# EAGLE schematic SGC.0 (EAGLE 7.0.0)
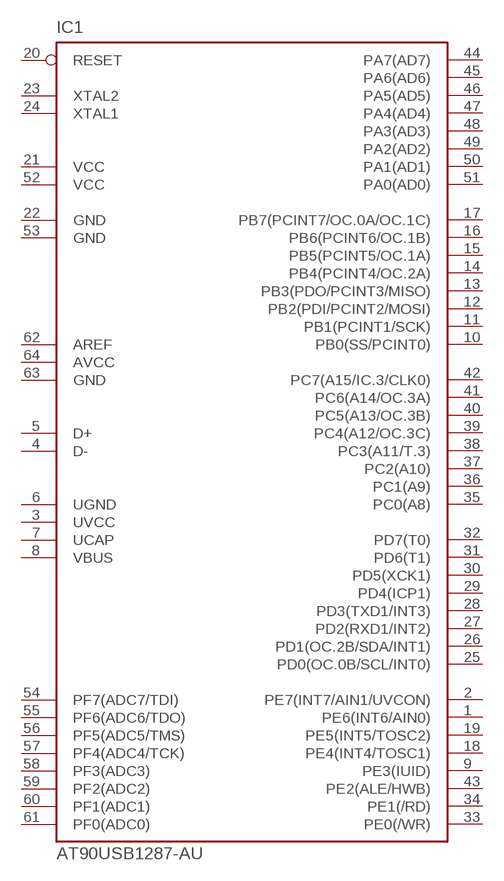
[diagram p0: schematic, sheet 1]

## Parts
IC1  AT90USB1287-AU  [TQFP64]
Unconnected: IC1.1(PE6(INT6/AIN0)) IC1.2(PE7(INT7/AIN1/UVCON)) IC1.4(D-) IC1.5(D+) IC1.9(PE3(IUID)) IC1.10(PB0(SS/PCINT0)) IC1.11(PB1(PCINT1/SCK)) IC1.12(PB2(PDI/PCINT2/MOSI)) IC1.13(PB3(PDO/PCINT3/MISO)) IC1.14(PB4(PCINT4/OC.2A)) IC1.15(PB5(PCINT5/OC.1A)) IC1.16(PB6(PCINT6/OC.1B)) IC1.17(PB7(PCINT7/OC.0A/OC.1C)) IC1.18(PE4(INT4/TOSC1)) IC1.19(PE5(INT5/TOSC2)) IC1.20(RESET) IC1.23(XTAL2) IC1.24(XTAL1) IC1.25(PD0(OC.0B/SCL/INT0)) IC1.26(PD1(OC.2B/SDA/INT1)) IC1.27(PD2(RXD1/INT2)) IC1.28(PD3(TXD1/INT3)) IC1.29(PD4(ICP1)) IC1.30(PD5(XCK1)) IC1.31(PD6(T1)) IC1.32(PD7(T0)) IC1.33(PE0(/WR)) IC1.34(PE1(/RD)) IC1.35(PC0(A8)) IC1.36(PC1(A9)) IC1.37(PC2(A10)) IC1.38(PC3(A11/T.3)) IC1.39(PC4(A12/OC.3C)) IC1.40(PC5(A13/OC.3B)) IC1.41(PC6(A14/OC.3A)) IC1.42(PC7(A15/IC.3/CLK0)) IC1.43(PE2(ALE/HWB)) IC1.44(PA7(AD7)) IC1.45(PA6(AD6)) IC1.46(PA5(AD5)) IC1.47(PA4(AD4)) IC1.48(PA3(AD3)) IC1.49(PA2(AD2)) IC1.50(PA1(AD1)) IC1.51(PA0(AD0)) IC1.54(PF7(ADC7/TDI)) IC1.55(PF6(ADC6/TDO)) IC1.56(PF5(ADC5/TMS)) IC1.57(PF4(ADC4/TCK)) IC1.58(PF3(ADC3)) IC1.59(PF2(ADC2)) IC1.60(PF1(ADC1)) IC1.61(PF0(ADC0)) IC1.62(AREF) IC1.64(AVCC)

## Power pins joined to a net without a drawn wire
GND: IC1.22(GND) IC1.53(GND) IC1.63(GND)
UCAP: IC1.7(UCAP)
UGND: IC1.6(UGND)
UVCC: IC1.3(UVCC)
VBUS: IC1.8(VBUS)
VCC: IC1.21(VCC) IC1.52(VCC)

## Library data of the parts
IC1 = at90usb:AT90USB1287-*: Atmel AT90USB1287 AVR Microcontroller with USB Interface and 128kB Flash Memory